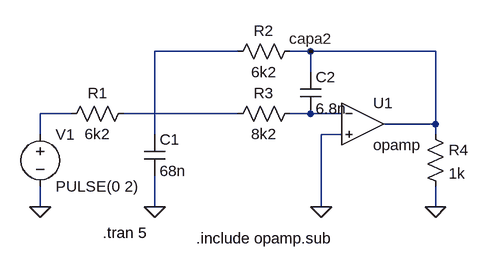
[diagram p0: schematic tarea_sdo_orden.asc]
tarea_sdo_orden.asc, the LTspice schematic file:
Version 4
SHEET 1 880 680
WIRE 272 0 144 0
WIRE 384 0 352 0
WIRE 576 0 384 0
WIRE 384 32 384 0
WIRE 16 96 -32 96
WIRE 272 96 96 96
WIRE 384 96 352 96
WIRE 432 96 384 96
WIRE 576 112 576 0
WIRE 576 112 496 112
WIRE -32 128 -32 96
WIRE 144 128 144 0
WIRE 432 128 400 128
WIRE 576 128 576 112
WIRE -32 240 -32 208
WIRE 144 240 144 192
WIRE 400 240 400 128
WIRE 576 240 576 208
FLAG 400 240 0
FLAG 576 240 0
FLAG 144 240 0
FLAG -32 240 0
FLAG 384 0 capa2
SYMBOL voltage -32 112 R0
WINDOW 123 0 0 Left 0
WINDOW 39 0 0 Left 0
SYMATTR InstName V1
SYMATTR Value PULSE(0 2)
SYMBOL res 112 80 R90
WINDOW 0 0 56 VBottom 2
WINDOW 3 32 56 VTop 2
SYMATTR InstName R1
SYMATTR Value 6k2
SYMBOL cap 128 128 R0
SYMATTR InstName C1
SYMATTR Value 68n
SYMBOL res 368 -16 R90
WINDOW 0 0 56 VBottom 2
WINDOW 3 32 56 VTop 2
SYMATTR InstName R2
SYMATTR Value 6k2
SYMBOL res 368 80 R90
WINDOW 0 0 56 VBottom 2
WINDOW 3 32 56 VTop 2
SYMATTR InstName R3
SYMATTR Value 8k2
SYMBOL Opamps\\opamp 464 48 R0
SYMATTR InstName U1
SYMBOL res 560 112 R0
SYMATTR InstName R4
SYMATTR Value 1k
SYMBOL cap 368 32 R0
SYMATTR InstName C2
SYMATTR Value 6.8n
TEXT 208 288 Left 2 !.include opamp.sub
TEXT 64 280 Left 2 !.tran 5

The netlist it stands for:
* tarea_sdo_orden.asc
V1 N002 0 PULSE(0 2)
R1 N003 N002 6k2
C1 N001 0 68n
R2 capa2 N001 6k2
R3 N004 N003 8k2
XU1 N004 0 capa2 opamp Aol=100K GBW=10Meg  ; pins invin noninvin out
R4 capa2 0 1k
C2 capa2 N004 6.8n
.include opamp.sub
.tran 5
.backanno
.end